# EAGLE schematic LPT Connector (EAGLE 4.14)
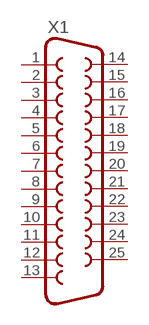
[diagram p0: schematic, sheet 1]

## Parts
X1  F25HP  [F25HP]
Unconnected: X1.1 X1.2 X1.3 X1.4 X1.5 X1.6 X1.7 X1.8 X1.9 X1.10 X1.11 X1.12 X1.13 X1.14 X1.15 X1.16 X1.17 X1.18 X1.19 X1.20 X1.21 X1.22 X1.23 X1.24 X1.25

## Library data of the parts
X1 = con-subd:F25: SUB-D